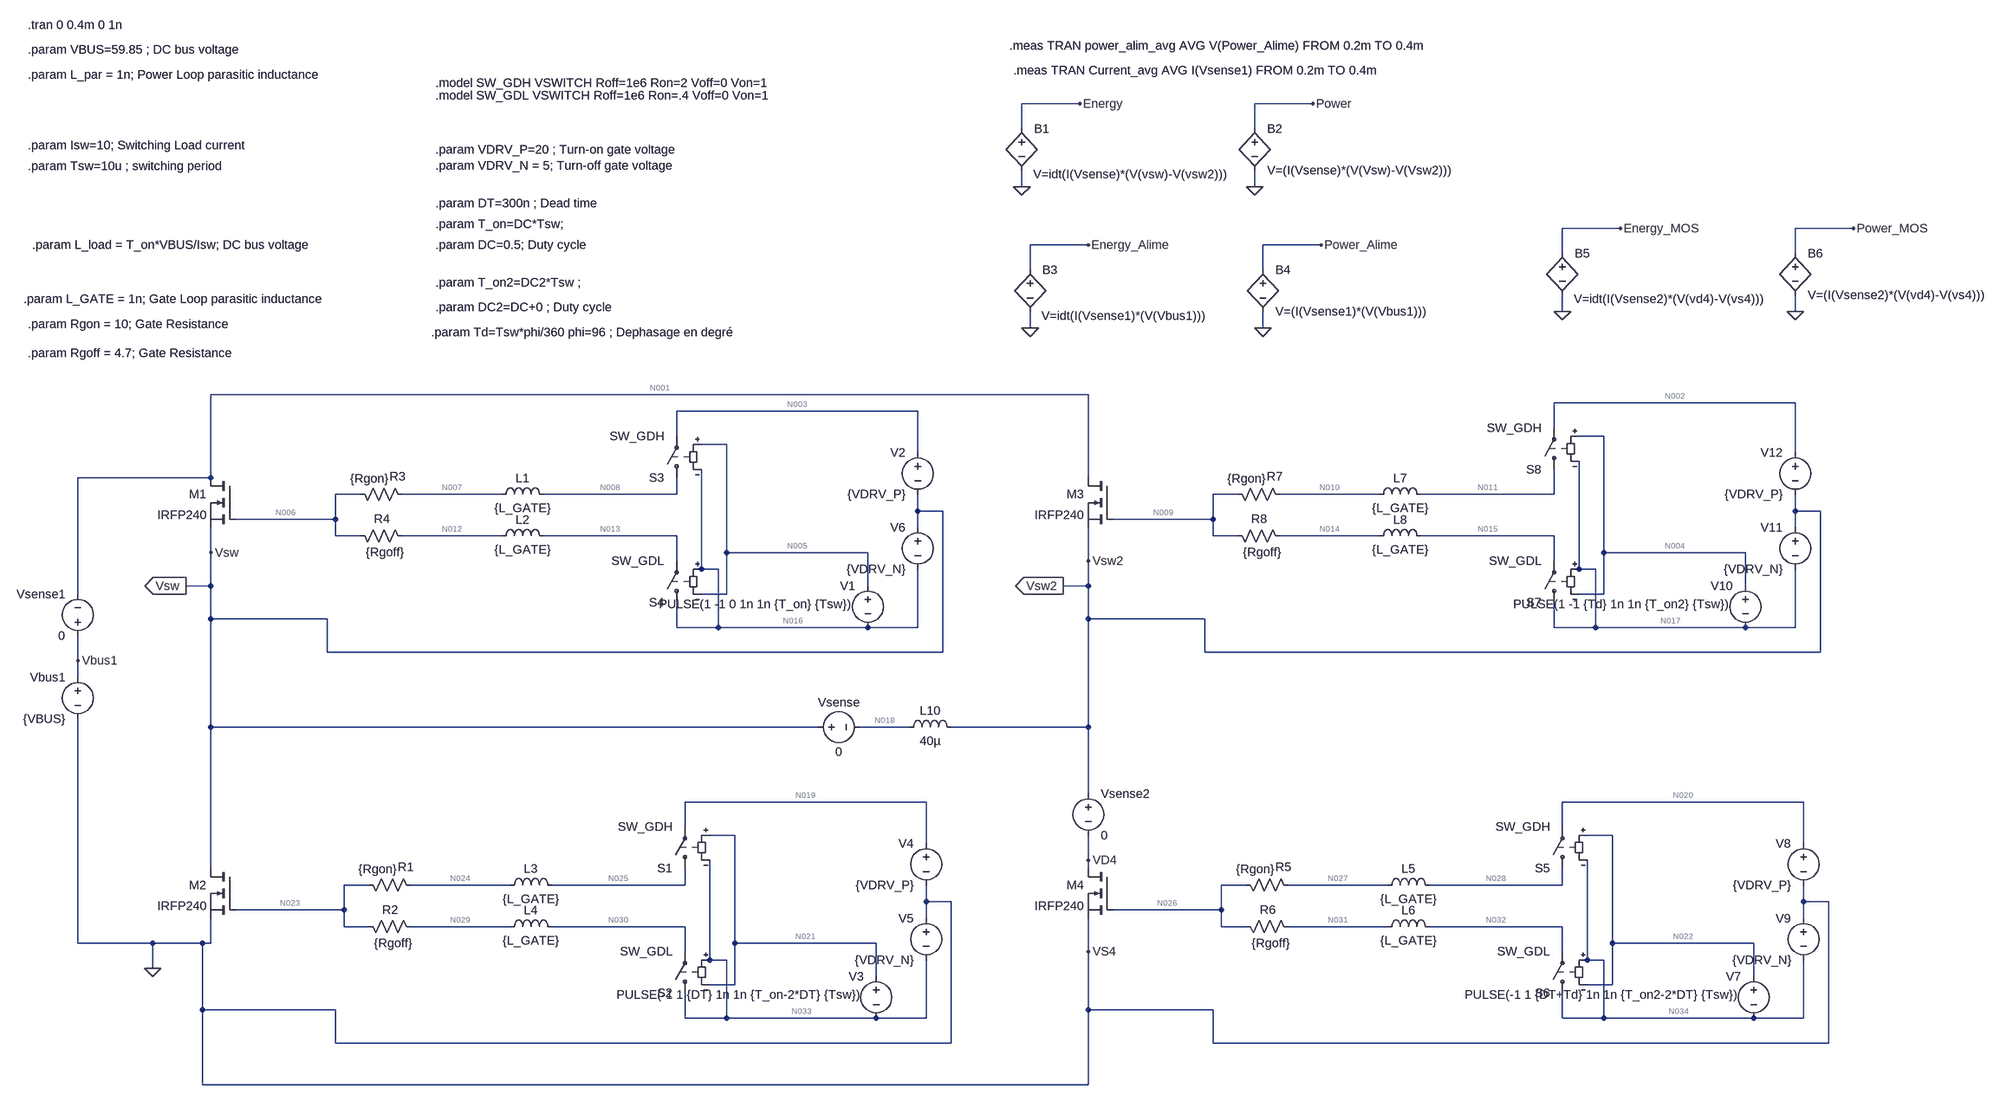
[diagram p0: schematic Hackathon_Si_Losses_full.asc]
Hackathon_Si_Losses_full.asc, the LTspice schematic file:
Version 4
SHEET 1 3000 1268
WIRE 912 -624 800 -624
WIRE 1360 -624 1248 -624
WIRE 800 -576 800 -624
WIRE 1248 -576 1248 -624
WIRE 800 -464 800 -496
WIRE 1248 -464 1248 -496
WIRE 1952 -384 1840 -384
WIRE 2400 -384 2288 -384
WIRE 928 -352 816 -352
WIRE 1376 -352 1264 -352
WIRE 1840 -336 1840 -384
WIRE 2288 -336 2288 -384
WIRE 816 -304 816 -352
WIRE 1264 -304 1264 -352
WIRE 1840 -224 1840 -256
WIRE 2288 -224 2288 -256
WIRE 816 -192 816 -224
WIRE 1264 -192 1264 -224
WIRE 928 -64 -800 -64
WIRE 2288 -48 1824 -48
WIRE 560 -32 96 -32
WIRE 1824 0 1824 -48
WIRE 96 16 96 -32
WIRE 1920 16 1872 16
WIRE 192 32 144 32
WIRE 560 48 560 -32
WIRE 2288 48 2288 -48
WIRE -800 96 -800 -64
WIRE -800 96 -1056 96
WIRE 928 96 928 -64
WIRE -512 128 -560 128
WIRE -240 128 -432 128
WIRE 96 128 96 96
WIRE 96 128 -160 128
WIRE 1216 128 1168 128
WIRE 1488 128 1296 128
WIRE 1824 128 1824 80
WIRE 1824 128 1568 128
WIRE 560 160 560 128
WIRE 608 160 560 160
WIRE 2288 160 2288 128
WIRE 2336 160 2288 160
WIRE -560 176 -560 128
WIRE -560 176 -752 176
WIRE 1168 176 1168 128
WIRE 1168 176 976 176
WIRE 560 192 560 160
WIRE 2288 192 2288 160
WIRE -560 208 -560 176
WIRE -512 208 -560 208
WIRE -240 208 -432 208
WIRE 96 208 -160 208
WIRE 1168 208 1168 176
WIRE 1216 208 1168 208
WIRE 1488 208 1296 208
WIRE 1824 208 1568 208
WIRE -800 240 -800 192
WIRE 192 240 192 32
WIRE 464 240 192 240
WIRE 1920 240 1920 16
WIRE 2192 240 1920 240
WIRE 96 256 96 208
WIRE 928 256 928 192
WIRE 1824 256 1824 208
WIRE 144 272 144 80
WIRE 176 272 144 272
WIRE 1872 272 1872 64
WIRE 1904 272 1872 272
WIRE -800 304 -800 240
WIRE -800 304 -848 304
WIRE 464 304 464 240
WIRE 928 304 928 256
WIRE 928 304 880 304
WIRE 2192 304 2192 240
WIRE -1056 320 -1056 96
WIRE 192 320 192 240
WIRE 192 320 144 320
WIRE 1920 320 1920 240
WIRE 1920 320 1872 320
WIRE -800 368 -800 304
WIRE -576 368 -800 368
WIRE 928 368 928 304
WIRE 1152 368 928 368
WIRE 96 384 96 336
WIRE 176 384 176 272
WIRE 176 384 96 384
WIRE 464 384 176 384
WIRE 560 384 560 272
WIRE 560 384 464 384
WIRE 1824 384 1824 336
WIRE 1904 384 1904 272
WIRE 1904 384 1824 384
WIRE 2192 384 1904 384
WIRE 2288 384 2288 272
WIRE 2288 384 2192 384
WIRE -576 432 -576 368
WIRE 608 432 608 160
WIRE 608 432 -576 432
WIRE 1152 432 1152 368
WIRE 2336 432 2336 160
WIRE 2336 432 1152 432
WIRE -1056 448 -1056 400
WIRE -1056 480 -1056 448
WIRE -800 576 -800 368
WIRE 368 576 -800 576
WIRE 544 576 448 576
WIRE 928 576 928 368
WIRE 928 576 624 576
WIRE 928 704 928 576
WIRE 576 720 112 720
WIRE 2304 720 1840 720
WIRE 112 768 112 720
WIRE 1840 768 1840 720
WIRE 208 784 160 784
WIRE 1936 784 1888 784
WIRE 576 800 576 720
WIRE 2304 800 2304 720
WIRE 928 832 928 784
WIRE -800 848 -800 576
WIRE 928 848 928 832
WIRE -496 880 -544 880
WIRE -224 880 -416 880
WIRE 112 880 112 848
WIRE 112 880 -144 880
WIRE 1232 880 1184 880
WIRE 1504 880 1312 880
WIRE 1840 880 1840 848
WIRE 1840 880 1584 880
WIRE 576 912 576 880
WIRE 624 912 576 912
WIRE 2304 912 2304 880
WIRE 2352 912 2304 912
WIRE -544 928 -544 880
WIRE -544 928 -752 928
WIRE 1184 928 1184 880
WIRE 1184 928 976 928
WIRE 576 944 576 912
WIRE 2304 944 2304 912
WIRE -544 960 -544 928
WIRE -496 960 -544 960
WIRE -224 960 -416 960
WIRE 112 960 -144 960
WIRE 1184 960 1184 928
WIRE 1232 960 1184 960
WIRE 1504 960 1312 960
WIRE 1840 960 1584 960
WIRE -1056 992 -1056 560
WIRE -912 992 -1056 992
WIRE -816 992 -912 992
WIRE -800 992 -800 944
WIRE -800 992 -816 992
WIRE 208 992 208 784
WIRE 480 992 208 992
WIRE 1936 992 1936 784
WIRE 2208 992 1936 992
WIRE 112 1008 112 960
WIRE 928 1008 928 944
WIRE 1840 1008 1840 960
WIRE 160 1024 160 832
WIRE 192 1024 160 1024
WIRE 1888 1024 1888 832
WIRE 1920 1024 1888 1024
WIRE -912 1040 -912 992
WIRE 480 1056 480 992
WIRE 2208 1056 2208 992
WIRE 208 1072 208 992
WIRE 208 1072 160 1072
WIRE 1936 1072 1936 992
WIRE 1936 1072 1888 1072
WIRE -816 1120 -816 992
WIRE -560 1120 -816 1120
WIRE 928 1120 928 1008
WIRE 1168 1120 928 1120
WIRE 112 1136 112 1088
WIRE 192 1136 192 1024
WIRE 192 1136 112 1136
WIRE 480 1136 192 1136
WIRE 576 1136 576 1024
WIRE 576 1136 480 1136
WIRE 1840 1136 1840 1088
WIRE 1920 1136 1920 1024
WIRE 1920 1136 1840 1136
WIRE 2208 1136 1920 1136
WIRE 2304 1136 2304 1024
WIRE 2304 1136 2208 1136
WIRE -560 1184 -560 1120
WIRE 624 1184 624 912
WIRE 624 1184 -560 1184
WIRE 1168 1184 1168 1120
WIRE 2352 1184 2352 912
WIRE 2352 1184 1168 1184
WIRE -816 1264 -816 1120
WIRE 928 1264 928 1120
WIRE 928 1264 -816 1264
FLAG -912 1040 0
FLAG -848 304 Vsw
IOPIN -848 304 Out
FLAG 880 304 Vsw2
IOPIN 880 304 Out
FLAG 1248 -464 0
FLAG 1360 -624 Power
FLAG 800 -464 0
FLAG 912 -624 Energy
FLAG 928 256 Vsw2
FLAG -800 240 Vsw
FLAG 1264 -192 0
FLAG 1376 -352 Power_Alime
FLAG 816 -192 0
FLAG 928 -352 Energy_Alime
FLAG -1056 448 Vbus1
FLAG 2288 -224 0
FLAG 2400 -384 Power_MOS
FLAG 1840 -224 0
FLAG 1952 -384 Energy_MOS
FLAG 928 832 VD4
FLAG 928 1008 VS4
SYMBOL nmos -752 96 M0
SYMATTR InstName M1
SYMATTR Value IRFP240
SYMBOL nmos -752 848 M0
SYMATTR InstName M2
SYMATTR Value IRFP240
SYMBOL voltage -1056 464 M0
WINDOW 123 0 0 Left 0
WINDOW 39 0 0 Left 0
SYMATTR InstName Vbus1
SYMATTR Value {VBUS}
SYMBOL sw 112 864 R180
SYMATTR InstName S1
SYMATTR Value SW_GDH
SYMBOL sw 112 1104 R180
SYMATTR InstName S2
SYMATTR Value SW_GDL
SYMBOL voltage 480 1040 M0
WINDOW 123 0 0 Left 2
WINDOW 39 0 0 Left 2
WINDOW 3 31 51 Left 2
SYMATTR Value PULSE(-1 1 {DT} 1n 1n {T_on-2*DT} {Tsw})
SYMATTR InstName V3
SYMBOL res -512 864 M90
WINDOW 0 -3 87 VBottom 2
WINDOW 3 -30 33 VTop 2
SYMATTR InstName R1
SYMATTR Value {Rgon}
SYMBOL res -512 944 M90
WINDOW 0 -1 57 VBottom 2
WINDOW 3 32 63 VTop 2
SYMATTR InstName R2
SYMATTR Value {Rgoff}
SYMBOL voltage 576 784 M0
WINDOW 123 0 0 Left 2
WINDOW 39 0 0 Left 2
SYMATTR InstName V4
SYMATTR Value {VDRV_P}
SYMBOL voltage 576 928 M0
WINDOW 123 0 0 Left 2
WINDOW 39 0 0 Left 2
SYMATTR InstName V5
SYMATTR Value {VDRV_N}
SYMBOL ind -128 896 M270
WINDOW 0 32 56 VTop 2
WINDOW 3 5 56 VBottom 2
SYMATTR InstName L3
SYMATTR Value {L_GATE}
SYMBOL ind -128 976 M270
WINDOW 0 32 56 VTop 2
WINDOW 3 5 56 VBottom 2
SYMATTR InstName L4
SYMATTR Value {L_GATE}
SYMBOL sw 96 112 R180
SYMATTR InstName S3
SYMATTR Value SW_GDH
SYMBOL sw 96 352 R180
SYMATTR InstName S4
SYMATTR Value SW_GDL
SYMBOL voltage 464 288 M0
WINDOW 123 0 0 Left 2
WINDOW 39 0 0 Left 2
WINDOW 3 31 51 Left 2
SYMATTR Value PULSE(1 -1 0 1n 1n {T_on} {Tsw})
SYMATTR InstName V1
SYMBOL res -528 112 M90
WINDOW 0 -3 87 VBottom 2
WINDOW 3 -30 33 VTop 2
SYMATTR InstName R3
SYMATTR Value {Rgon}
SYMBOL res -528 192 M90
WINDOW 0 -1 57 VBottom 2
WINDOW 3 32 63 VTop 2
SYMATTR InstName R4
SYMATTR Value {Rgoff}
SYMBOL voltage 560 32 M0
WINDOW 123 0 0 Left 2
WINDOW 39 0 0 Left 2
SYMATTR InstName V2
SYMATTR Value {VDRV_P}
SYMBOL voltage 560 176 M0
WINDOW 123 0 0 Left 2
WINDOW 39 0 0 Left 2
SYMATTR InstName V6
SYMATTR Value {VDRV_N}
SYMBOL ind -144 144 M270
WINDOW 0 32 56 VTop 2
WINDOW 3 5 56 VBottom 2
SYMATTR InstName L1
SYMATTR Value {L_GATE}
SYMBOL ind -144 224 M270
WINDOW 0 32 56 VTop 2
WINDOW 3 5 56 VBottom 2
SYMATTR InstName L2
SYMATTR Value {L_GATE}
SYMBOL nmos 976 96 M0
SYMATTR InstName M3
SYMATTR Value IRFP240
SYMBOL nmos 976 848 M0
SYMATTR InstName M4
SYMATTR Value IRFP240
SYMBOL sw 1840 864 R180
SYMATTR InstName S5
SYMATTR Value SW_GDH
SYMBOL sw 1840 1104 R180
SYMATTR InstName S6
SYMATTR Value SW_GDL
SYMBOL voltage 2208 1040 M0
WINDOW 123 0 0 Left 2
WINDOW 39 0 0 Left 2
WINDOW 3 31 51 Left 2
SYMATTR Value PULSE(-1 1 {DT+Td} 1n 1n {T_on2-2*DT} {Tsw})
SYMATTR InstName V7
SYMBOL res 1216 864 M90
WINDOW 0 -3 87 VBottom 2
WINDOW 3 -30 33 VTop 2
SYMATTR InstName R5
SYMATTR Value {Rgon}
SYMBOL res 1216 944 M90
WINDOW 0 -1 57 VBottom 2
WINDOW 3 32 63 VTop 2
SYMATTR InstName R6
SYMATTR Value {Rgoff}
SYMBOL voltage 2304 784 M0
WINDOW 123 0 0 Left 2
WINDOW 39 0 0 Left 2
SYMATTR InstName V8
SYMATTR Value {VDRV_P}
SYMBOL voltage 2304 928 M0
WINDOW 123 0 0 Left 2
WINDOW 39 0 0 Left 2
SYMATTR InstName V9
SYMATTR Value {VDRV_N}
SYMBOL ind 1600 896 M270
WINDOW 0 32 56 VTop 2
WINDOW 3 5 56 VBottom 2
SYMATTR InstName L5
SYMATTR Value {L_GATE}
SYMBOL ind 1600 976 M270
WINDOW 0 32 56 VTop 2
WINDOW 3 5 56 VBottom 2
SYMATTR InstName L6
SYMATTR Value {L_GATE}
SYMBOL sw 1824 352 R180
SYMATTR InstName S7
SYMATTR Value SW_GDL
SYMBOL voltage 2192 288 M0
WINDOW 123 0 0 Left 2
WINDOW 39 0 0 Left 2
WINDOW 3 31 51 Left 2
SYMATTR Value PULSE(1 -1 {Td} 1n 1n {T_on2} {Tsw})
SYMATTR InstName V10
SYMBOL res 1200 112 M90
WINDOW 0 -3 87 VBottom 2
WINDOW 3 -30 33 VTop 2
SYMATTR InstName R7
SYMATTR Value {Rgon}
SYMBOL res 1200 192 M90
WINDOW 0 -1 57 VBottom 2
WINDOW 3 32 63 VTop 2
SYMATTR InstName R8
SYMATTR Value {Rgoff}
SYMBOL voltage 2288 176 M0
WINDOW 123 0 0 Left 2
WINDOW 39 0 0 Left 2
SYMATTR InstName V11
SYMATTR Value {VDRV_N}
SYMBOL ind 1584 144 M270
WINDOW 0 32 56 VTop 2
WINDOW 3 5 56 VBottom 2
SYMATTR InstName L7
SYMATTR Value {L_GATE}
SYMBOL ind 1584 224 M270
WINDOW 0 32 56 VTop 2
WINDOW 3 5 56 VBottom 2
SYMATTR InstName L8
SYMATTR Value {L_GATE}
SYMBOL ind 528 592 R270
WINDOW 0 32 56 VTop 2
WINDOW 3 5 56 VBottom 2
SYMATTR InstName L10
SYMATTR Value 40µ
SYMATTR SpiceLine Rser=0.07
SYMBOL sw 1824 96 R180
SYMATTR InstName S8
SYMATTR Value SW_GDH
SYMBOL voltage 2288 32 M0
WINDOW 123 0 0 Left 2
WINDOW 39 0 0 Left 2
SYMATTR InstName V12
SYMATTR Value {VDRV_P}
SYMBOL bv 800 -592 R0
WINDOW 3 22 104 Left 2
SYMATTR Value V=idt(I(Vsense)*(V(vsw)-V(vsw2)))
SYMATTR InstName B1
SYMBOL bv 1248 -592 R0
SYMATTR InstName B2
SYMATTR Value V=(I(Vsense)*(V(Vsw)-V(Vsw2)))
SYMBOL voltage 352 576 R270
WINDOW 0 32 56 VTop 2
WINDOW 3 -32 56 VBottom 2
SYMATTR InstName Vsense
SYMATTR Value 0
SYMBOL voltage -1056 416 R180
WINDOW 0 24 96 Left 2
WINDOW 3 24 16 Left 2
SYMATTR InstName Vsense1
SYMATTR Value 0
SYMBOL bv 816 -320 R0
WINDOW 3 22 104 Left 2
SYMATTR Value V=idt(I(Vsense1)*(V(Vbus1)))
SYMATTR InstName B3
SYMBOL bv 1264 -320 R0
SYMATTR InstName B4
SYMATTR Value V=(I(Vsense1)*(V(Vbus1)))
SYMBOL bv 1840 -352 R0
WINDOW 3 22 104 Left 2
SYMATTR Value V=idt(I(Vsense2)*(V(vd4)-V(vs4)))
SYMATTR InstName B5
SYMBOL bv 2288 -352 R0
SYMATTR InstName B6
SYMATTR Value V=(I(Vsense2)*(V(vd4)-V(vs4)))
SYMBOL voltage 928 688 R0
WINDOW 123 0 0 Left 0
WINDOW 39 0 0 Left 0
SYMATTR InstName Vsense2
SYMATTR Value 0
TEXT -1152 -776 Left 2 !.tran 0 0.4m 0 1n
TEXT -1152 -728 Left 2 !.param VBUS=59.85 ; DC bus voltage
TEXT -1152 -680 Left 2 !.param L_par = 1n; Power Loop parasitic inductance
TEXT -1152 -544 Left 2 !.param Isw=10; Switching Load current
TEXT -1152 -504 Left 2 !.param Tsw=10u ; switching period
TEXT -368 -352 Left 2 !.param DC=0.5; Duty cycle
TEXT -368 -392 Left 2 !.param T_on=DC*Tsw;
TEXT -1144 -352 Left 2 !.param L_load = T_on*VBUS/Isw; DC bus voltage
TEXT -368 -432 Left 2 !.param DT=300n ; Dead time
TEXT -1160 -248 Left 2 !.param L_GATE = 1n; Gate Loop parasitic inductance
TEXT -1152 -200 Left 2 !.param Rgon = 10; Gate Resistance
TEXT -368 -664 Left 2 !.model SW_GDH VSWITCH Roff=1e6 Ron=2 Voff=0 Von=1
TEXT -368 -640 Left 2 !.model SW_GDL VSWITCH Roff=1e6 Ron=.4 Voff=0 Von=1
TEXT -368 -536 Left 2 !.param VDRV_P=20 ; Turn-on gate voltage\n.param VDRV_N = 5; Turn-off gate voltage
TEXT -1152 -144 Left 2 !.param Rgoff = 4.7; Gate Resistance
TEXT -368 -232 Left 2 !.param DC2=DC+0 ; Duty cycle
TEXT -368 -280 Left 2 !.param T_on2=DC2*Tsw ;
TEXT -376 -184 Left 2 !.param Td=Tsw*phi/360 phi=96 ; Dephasage en degré
TEXT 776 -736 Left 2 !.meas TRAN power_alim_avg AVG V(Power_Alime) FROM 0.2m TO 0.4m
TEXT 784 -688 Left 2 !.meas TRAN Current_avg AVG I(Vsense1) FROM 0.2m TO 0.4m

The netlist it stands for:
* Hackathon_Si_Losses_full.asc
M1 N001 N006 Vsw Vsw IRFP240
M2 Vsw N023 0 0 IRFP240
Vbus1 Vbus1 0 {VBUS}
S1 N025 N019 N021 N033 SW_GDH
S2 N033 N030 N033 N021 SW_GDL
V3 N021 N033 PULSE(-1 1 {DT} 1n 1n {T_on-2*DT} {Tsw})
R1 N023 N024 {Rgon}
R2 N023 N029 {Rgoff}
V4 N019 0 {VDRV_P}
V5 0 N033 {VDRV_N}
L3 N025 N024 {L_GATE}
L4 N030 N029 {L_GATE}
S3 N008 N003 N005 N016 SW_GDH
S4 N016 N013 N016 N005 SW_GDL
V1 N005 N016 PULSE(1 -1 0 1n 1n {T_on} {Tsw})
R3 N006 N007 {Rgon}
R4 N006 N012 {Rgoff}
V2 N003 Vsw {VDRV_P}
V6 Vsw N016 {VDRV_N}
L1 N008 N007 {L_GATE}
L2 N013 N012 {L_GATE}
M3 N001 N009 Vsw2 Vsw2 IRFP240
M4 VD4 N026 0 0 IRFP240
S5 N028 N020 N022 N034 SW_GDH
S6 N034 N032 N034 N022 SW_GDL
V7 N022 N034 PULSE(-1 1 {DT+Td} 1n 1n {T_on2-2*DT} {Tsw})
R5 N026 N027 {Rgon}
R6 N026 N031 {Rgoff}
V8 N020 0 {VDRV_P}
V9 0 N034 {VDRV_N}
L5 N028 N027 {L_GATE}
L6 N032 N031 {L_GATE}
S7 N017 N015 N017 N004 SW_GDL
V10 N004 N017 PULSE(1 -1 {Td} 1n 1n {T_on2} {Tsw})
R7 N009 N010 {Rgon}
R8 N009 N014 {Rgoff}
V11 Vsw2 N017 {VDRV_N}
L7 N011 N010 {L_GATE}
L8 N015 N014 {L_GATE}
L10 N018 Vsw2 40µ Rser=0.07
S8 N011 N002 N004 N017 SW_GDH
V12 N002 Vsw2 {VDRV_P}
B1 Energy 0 V=idt(I(Vsense)*(V(vsw)-V(vsw2)))
B2 Power 0 V=(I(Vsense)*(V(Vsw)-V(Vsw2)))
Vsense Vsw N018 0
Vsense1 Vbus1 N001 0
B3 Energy_Alime 0 V=idt(I(Vsense1)*(V(Vbus1)))
B4 Power_Alime 0 V=(I(Vsense1)*(V(Vbus1)))
B5 Energy_MOS 0 V=idt(I(Vsense2)*(V(vd4)-V(vs4)))
B6 Power_MOS 0 V=(I(Vsense2)*(V(vd4)-V(vs4)))
Vsense2 Vsw2 VD4 0
.model NMOS NMOS
.model PMOS PMOS
.lib standard.mos
.tran 0 0.4m 0 1n
.param VBUS=59.85 ; DC bus voltage
.param L_par = 1n; Power Loop parasitic inductance
.param Isw=10; Switching Load current
.param Tsw=10u ; switching period
.param DC=0.5; Duty cycle
.param T_on=DC*Tsw;
.param L_load = T_on*VBUS/Isw; DC bus voltage
.param DT=300n ; Dead time
.param L_GATE = 1n; Gate Loop parasitic inductance
.param Rgon = 10; Gate Resistance
.model SW_GDH VSWITCH Roff=1e6 Ron=2 Voff=0 Von=1
.model SW_GDL VSWITCH Roff=1e6 Ron=.4 Voff=0 Von=1
.param VDRV_P=20 ; Turn-on gate voltage
.param VDRV_N = 5; Turn-off gate voltage
.param Rgoff = 4.7; Gate Resistance
.param DC2=DC+0 ; Duty cycle
.param T_on2=DC2*Tsw ;
.param Td=Tsw*phi/360 phi=96 ; Dephasage en degré
.meas TRAN power_alim_avg AVG V(Power_Alime) FROM 0.2m TO 0.4m
.meas TRAN Current_avg AVG I(Vsense1) FROM 0.2m TO 0.4m
.backanno
.end

* Results of the author's LTspice run, read from the files saved beside the schematic
* Operating Point, zero values left out:
*   V(n001) = 59.85 V
*   V(n006) = 79.85 V
*   V(vsw) = 59.85 V
*   V(n023) = -5 V
*   V(vbus1) = 59.85 V
*   V(n025) = -5 V
*   V(n019) = 20 V
*   V(n021) = -6 V
*   V(n033) = -5 V
*   V(n030) = -5 V
*   V(n024) = -5 V
*   V(n029) = -5 V
*   V(n008) = 79.85 V
*   V(n003) = 79.85 V
*   V(n005) = 55.85 V
*   V(n016) = 54.85 V
*   V(n013) = 79.85 V
*   V(n007) = 79.85 V
*   V(n012) = 79.85 V
*   V(n009) = 79.85 V
*   V(vsw2) = 59.85 V
*   V(vd4) = 59.85 V
*   V(n026) = -5 V
*   V(n028) = -5 V
*   V(n020) = 20 V
*   V(n022) = -6 V
*   V(n034) = -5 V
*   V(n032) = -5 V
*   V(n027) = -5 V
*   V(n031) = -5 V
*   V(n017) = 54.85 V
*   V(n015) = 79.85 V
*   V(n004) = 55.85 V
*   V(n010) = 79.85 V
*   V(n014) = 79.85 V
*   V(n011) = 79.85 V
*   V(n018) = 59.85 V
*   V(n002) = 79.85 V
*   Id(M1) = 183.3 pA
*   Is(M1) = -183.3 pA
*   Id(M2) = 126.7 pA
*   Is(M2) = -126.7 pA
*   Id(M3) = 182.2 pA
*   Is(M3) = -182.2 pA
*   Id(M4) = 126.7 pA
*   Is(M4) = -126.7 pA
*   I(L3) = 25 µA
*   I(L4) = -25 µA
*   I(L1) = 25 µA
*   I(L2) = -25 µA
*   I(L5) = 25 µA
*   I(L6) = -25 µA
*   I(L7) = 25 µA
*   I(L8) = -25 µA
*   I(L10) = -1.32 pA
*   I(R1) = -25 µA
*   I(R2) = 25 µA
*   I(R3) = -25 µA
*   I(R4) = 25 µA
*   I(R5) = -25 µA
*   I(R6) = 25 µA
*   I(R7) = -25 µA
*   I(R8) = 25 µA
*   I(S1) = 25 µA
*   I(S3) = 25 µA
*   I(S5) = 25 µA
*   I(S8) = 25 µA
*   I(S2) = 25 µA
*   I(S4) = 25 µA
*   I(S6) = 25 µA
*   I(S7) = 25 µA
*   I(Vbus1) = -364.9 pA
*   I(V4) = -25 µA
*   I(V5) = -25 µA
*   I(V2) = -25 µA
*   I(V6) = -25 µA
*   I(V8) = -25 µA
*   I(V9) = -25 µA
*   I(V11) = -25 µA
*   I(V12) = -25 µA
*   I(Vsense) = -1.322 pA
*   I(Vsense1) = 364.9 pA
*   I(Vsense2) = 186.6 pA
* From the log:
*   power_alim_avg: AVG(v(power_alime))=0.872175 FROM 0.0002 TO 0.0004
*   current_avg: AVG(i(vsense1))=0.0145724 FROM 0.0002 TO 0.0004